# EAGLE schematic PCB_V1 v3 (EAGLE 9.7.0)
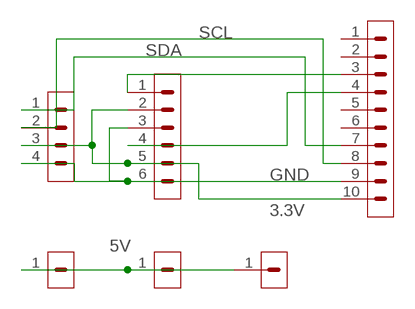
[diagram p0: schematic, sheet 1]

## Parts
JP1  PINHD-1X10  [1X10]
JP2  PINHD-1X1  [1X01]
JP3  PINHD-1X1  [1X01]
JP4  PINHD-1X1  [1X01]
PI_CONNECTOR  PINHD-1X4  [1X04]
SENSOR_CONNECTOR  PINHD-1X6  [1X06]

## Nets
3.3V: JP1.10 PI_CONNECTOR.3 SENSOR_CONNECTOR.2 SENSOR_CONNECTOR.5
5V: JP2.1 JP3.1 JP4.1
GND: JP1.9 PI_CONNECTOR.4 SENSOR_CONNECTOR.3 SENSOR_CONNECTOR.6
N$3: JP1.4 SENSOR_CONNECTOR.4
N$4: JP1.3 SENSOR_CONNECTOR.1
SCL: JP1.8 PI_CONNECTOR.2
SDA: JP1.7 PI_CONNECTOR.1
Unconnected: JP1.1 JP1.2 JP1.5 JP1.6

## Library data of the parts
JP1 = Connector:PINHD-1X10: Pin Header; CATEGORY: Connectors; DESCRIPTION: Header-Straight-10 Position; PACKAGE_TYPE: Through Hole; PITCH: 0.100" (2.54mm); SUBCATEGORY: Headers; TYPE: Male Pins
JP2-JP4 = Connector:PINHD-1X1: Pin Header; CATEGORY: Connectors; DESCRIPTION: Header-Straight-1 Position; PACKAGE_TYPE: Through Hole; PITCH: 0.100" (2.54mm); SUBCATEGORY: Headers; TYPE: Male Pins
PI_CONNECTOR = Connector:PINHD-1X4: Pin Header; CATEGORY: Connectors; DESCRIPTION: Header-Straight-4 Position; PACKAGE_TYPE: Through Hole; PITCH: 0.100" (2.54mm); SUBCATEGORY: Headers; TYPE: Male Pins
SENSOR_CONNECTOR = Connector:PINHD-1X6: Pin Header; CATEGORY: Connectors; DESCRIPTION: Header-Straight-6 Position; PACKAGE_TYPE: Through Hole; PITCH: 0.100" (2.54mm); SUBCATEGORY: Headers; TYPE: Male Pins